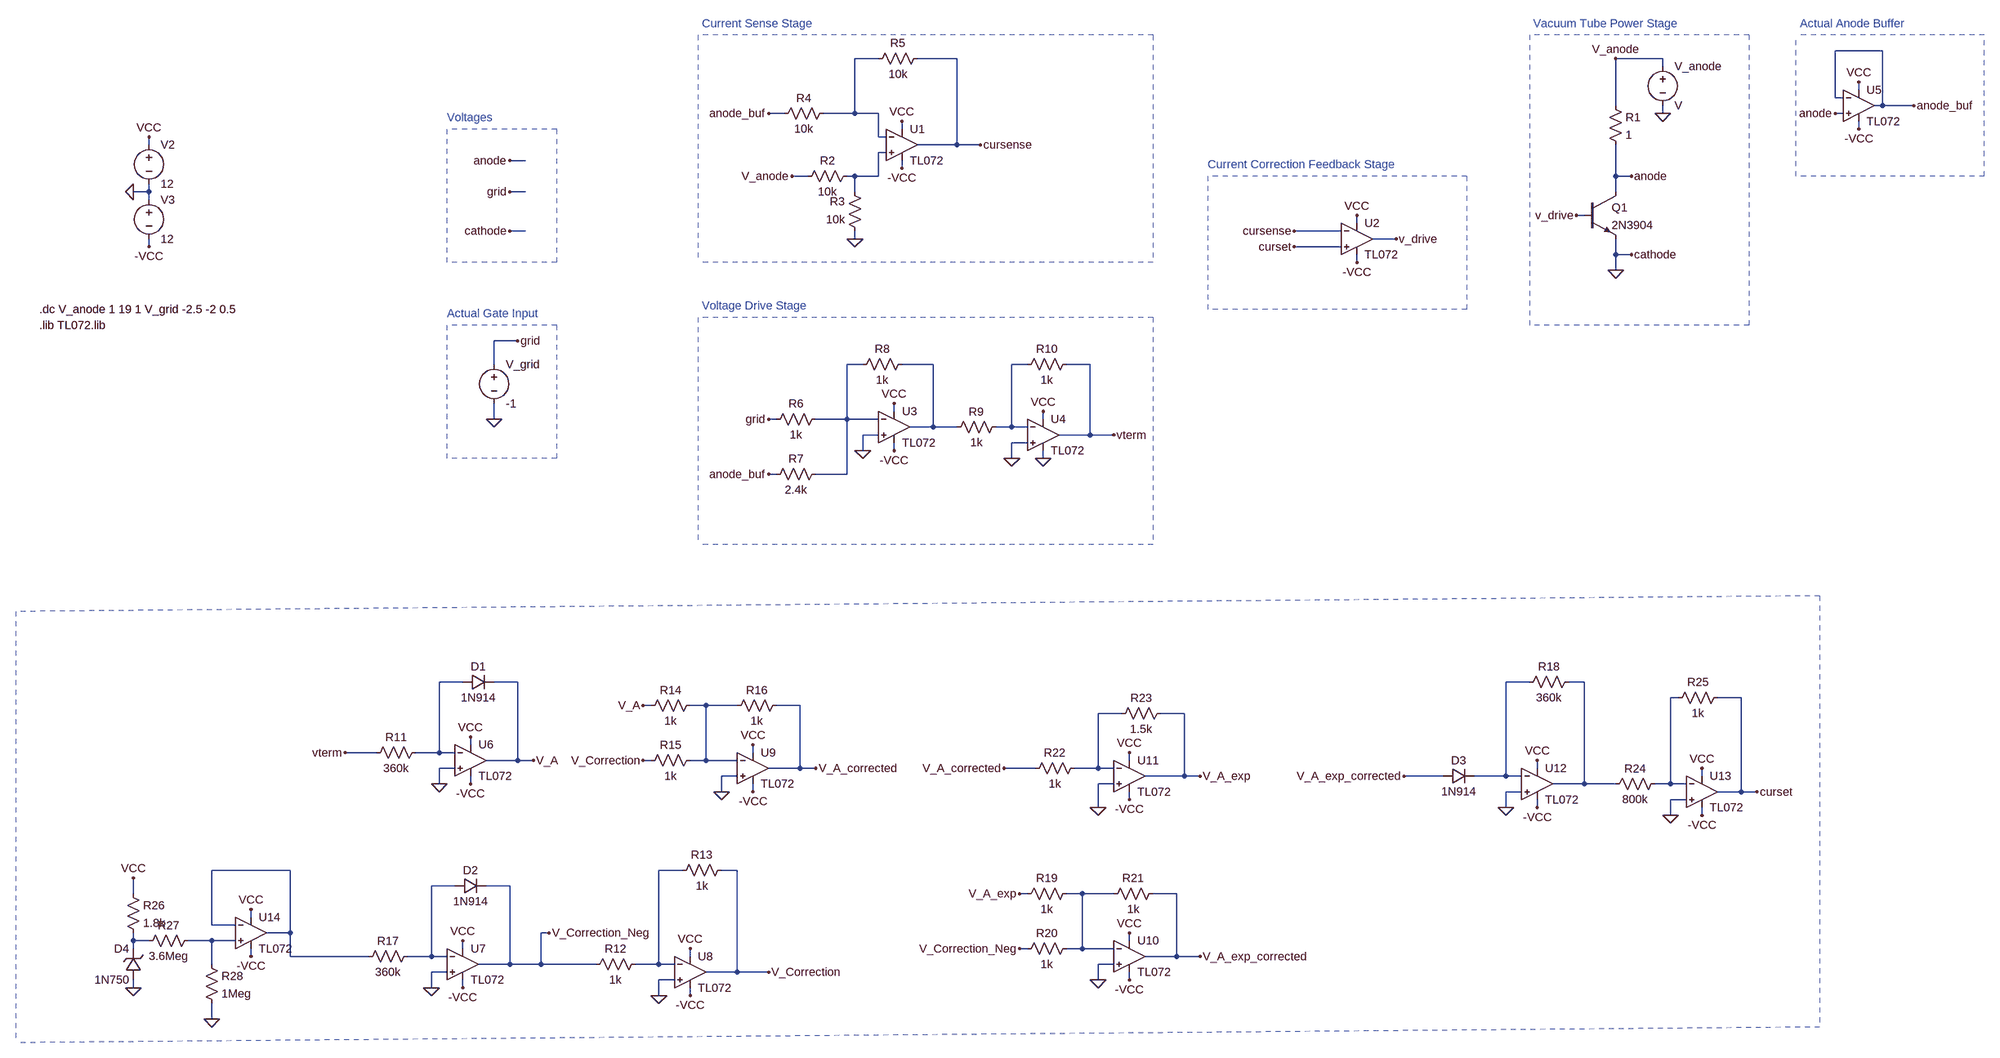
[diagram p0: schematic tube_third_iteration.asc]
tube_third_iteration.asc, the LTspice schematic file:
Version 4
SHEET 1 4020 1796
WIRE 3184 -400 3088 -400
WIRE 1136 -384 1088 -384
WIRE 1296 -384 1216 -384
WIRE 2736 -384 2640 -384
WIRE 2736 -368 2736 -384
WIRE 3136 -320 3136 -336
WIRE 3088 -304 3088 -400
WIRE 3104 -304 3088 -304
WIRE 2640 -288 2640 -384
WIRE 3184 -288 3184 -400
WIRE 3184 -288 3168 -288
WIRE 3248 -288 3184 -288
WIRE 944 -272 912 -272
WIRE 1088 -272 1088 -384
WIRE 1088 -272 1024 -272
WIRE 1136 -272 1088 -272
WIRE 2736 -272 2736 -288
WIRE 3104 -272 3088 -272
WIRE 1184 -240 1184 -256
WIRE 3136 -240 3136 -256
WIRE 1136 -224 1136 -272
WIRE 1152 -224 1136 -224
WIRE -352 -208 -352 -224
WIRE 1296 -208 1296 -384
WIRE 1296 -208 1216 -208
WIRE 1344 -208 1296 -208
WIRE 1152 -192 1136 -192
WIRE 416 -176 384 -176
WIRE 1184 -160 1184 -176
WIRE 992 -144 960 -144
WIRE 1088 -144 1072 -144
WIRE 1136 -144 1136 -192
WIRE 1136 -144 1088 -144
WIRE 2640 -144 2640 -208
WIRE 2672 -144 2640 -144
WIRE -352 -112 -352 -128
WIRE -352 -112 -384 -112
WIRE 416 -112 384 -112
WIRE 1088 -112 1088 -144
WIRE 2640 -112 2640 -144
WIRE -352 -96 -352 -112
WIRE 2576 -64 2560 -64
WIRE 2112 -48 2112 -64
WIRE 416 -32 384 -32
WIRE 2080 -32 1984 -32
WIRE 1088 -16 1088 -32
WIRE 2192 -16 2144 -16
WIRE -352 0 -352 -16
WIRE 2080 0 1984 0
WIRE 2640 16 2640 -16
WIRE 2672 16 2640 16
WIRE 2112 32 2112 16
WIRE 2640 48 2640 16
WIRE 400 192 352 192
WIRE 352 240 352 192
WIRE 1104 240 1072 240
WIRE 1248 240 1184 240
WIRE 1440 240 1408 240
WIRE 1568 240 1520 240
WIRE 1168 336 1168 320
WIRE 352 352 352 320
WIRE 928 352 912 352
WIRE 1072 352 1072 240
WIRE 1072 352 1008 352
WIRE 1136 352 1072 352
WIRE 1472 352 1472 336
WIRE 1248 368 1248 240
WIRE 1248 368 1200 368
WIRE 1296 368 1248 368
WIRE 1408 368 1408 240
WIRE 1408 368 1376 368
WIRE 1440 368 1408 368
WIRE 1136 384 1104 384
WIRE 1568 384 1568 240
WIRE 1568 384 1504 384
WIRE 1616 384 1568 384
WIRE 1440 400 1408 400
WIRE 1104 416 1104 384
WIRE 1168 416 1168 400
WIRE 1408 432 1408 400
WIRE 1472 432 1472 416
WIRE 928 464 912 464
WIRE 1072 464 1072 352
WIRE 1072 464 1008 464
WIRE 288 1040 240 1040
WIRE 400 1040 352 1040
WIRE 2464 1040 2416 1040
WIRE 2576 1040 2544 1040
WIRE 2768 1072 2752 1072
WIRE 2896 1072 2848 1072
WIRE 672 1088 656 1088
WIRE 784 1088 752 1088
WIRE 848 1088 784 1088
WIRE 976 1088 928 1088
WIRE 1632 1104 1584 1104
WIRE 1760 1104 1712 1104
WIRE 304 1168 304 1152
WIRE 112 1184 48 1184
WIRE 240 1184 240 1040
WIRE 240 1184 192 1184
WIRE 272 1184 240 1184
WIRE 880 1184 880 1168
WIRE 400 1200 400 1040
WIRE 400 1200 336 1200
WIRE 432 1200 400 1200
WIRE 672 1200 656 1200
WIRE 784 1200 784 1088
WIRE 784 1200 752 1200
WIRE 848 1200 784 1200
WIRE 1648 1200 1648 1184
WIRE 272 1216 240 1216
WIRE 976 1216 976 1088
WIRE 976 1216 912 1216
WIRE 1008 1216 976 1216
WIRE 1456 1216 1392 1216
WIRE 1584 1216 1584 1104
WIRE 1584 1216 1536 1216
WIRE 1616 1216 1584 1216
WIRE 2480 1216 2480 1200
WIRE 848 1232 816 1232
WIRE 1760 1232 1760 1104
WIRE 1760 1232 1680 1232
WIRE 1792 1232 1760 1232
WIRE 2288 1232 2208 1232
WIRE 2416 1232 2416 1040
WIRE 2416 1232 2352 1232
WIRE 2448 1232 2416 1232
WIRE 2816 1232 2816 1216
WIRE 240 1248 240 1216
WIRE 304 1248 304 1232
WIRE 1616 1248 1584 1248
WIRE 2576 1248 2576 1040
WIRE 2576 1248 2512 1248
WIRE 2640 1248 2576 1248
WIRE 2752 1248 2752 1072
WIRE 2752 1248 2720 1248
WIRE 2784 1248 2752 1248
WIRE 816 1264 816 1232
WIRE 880 1264 880 1248
WIRE 2448 1264 2416 1264
WIRE 2896 1264 2896 1072
WIRE 2896 1264 2848 1264
WIRE 2928 1264 2896 1264
WIRE 1648 1280 1648 1264
WIRE 2784 1280 2752 1280
WIRE 1584 1296 1584 1248
WIRE 2416 1296 2416 1264
WIRE 2480 1296 2480 1280
WIRE 2752 1312 2752 1280
WIRE 2816 1312 2816 1296
WIRE -64 1424 -224 1424
WIRE 736 1424 688 1424
WIRE 848 1424 816 1424
WIRE 272 1456 224 1456
WIRE 384 1456 336 1456
WIRE -384 1472 -384 1440
WIRE 1440 1472 1424 1472
WIRE 1552 1472 1520 1472
WIRE 1616 1472 1552 1472
WIRE 1744 1472 1696 1472
WIRE -144 1520 -144 1504
WIRE -224 1536 -224 1424
WIRE -176 1536 -224 1536
WIRE -64 1552 -64 1424
WIRE -64 1552 -112 1552
WIRE 464 1552 448 1552
WIRE -384 1568 -384 1552
WIRE -352 1568 -384 1568
WIRE -224 1568 -272 1568
WIRE -176 1568 -224 1568
WIRE 1648 1568 1648 1552
WIRE -384 1584 -384 1568
WIRE 288 1584 288 1568
WIRE 1440 1584 1424 1584
WIRE 1552 1584 1552 1472
WIRE 1552 1584 1520 1584
WIRE 1616 1584 1552 1584
WIRE -144 1600 -144 1584
WIRE -64 1600 -64 1552
WIRE 96 1600 -64 1600
WIRE 224 1600 224 1456
WIRE 224 1600 176 1600
WIRE 256 1600 224 1600
WIRE 752 1600 752 1584
WIRE 1744 1600 1744 1472
WIRE 1744 1600 1680 1600
WIRE 1792 1600 1744 1600
WIRE -224 1616 -224 1568
WIRE 384 1616 384 1456
WIRE 384 1616 320 1616
WIRE 448 1616 448 1552
WIRE 448 1616 384 1616
WIRE 560 1616 448 1616
WIRE 688 1616 688 1424
WIRE 688 1616 640 1616
WIRE 720 1616 688 1616
WIRE 1616 1616 1584 1616
WIRE 256 1632 224 1632
WIRE 848 1632 848 1424
WIRE 848 1632 784 1632
WIRE 912 1632 848 1632
WIRE 720 1648 688 1648
WIRE 1584 1648 1584 1616
WIRE 1648 1648 1648 1632
WIRE -384 1664 -384 1648
WIRE 224 1664 224 1632
WIRE 288 1664 288 1648
WIRE 688 1680 688 1648
WIRE 752 1680 752 1664
WIRE -224 1728 -224 1696
FLAG -384 -112 0
FLAG -352 -224 VCC
FLAG -352 0 -VCC
FLAG 2640 48 0
FLAG 3248 -288 anode_buf
FLAG 1088 -16 0
FLAG 1184 -256 VCC
FLAG 1184 -160 -VCC
FLAG 912 -272 anode_buf
FLAG 1344 -208 cursense
FLAG 1984 -32 cursense
FLAG 2112 -64 VCC
FLAG 2112 32 -VCC
FLAG 400 192 grid
FLAG 352 352 0
FLAG 1104 416 0
FLAG 1168 320 VCC
FLAG 912 464 anode_buf
FLAG 912 352 grid
FLAG 1408 432 0
FLAG 1472 336 VCC
FLAG 1616 384 vterm
FLAG 1168 416 -VCC
FLAG 1472 432 0
FLAG 3136 -336 VCC
FLAG 3136 -240 -VCC
FLAG 2736 -272 0
FLAG 2640 -384 V_anode
FLAG 960 -144 V_anode
FLAG 2672 -144 anode
FLAG 3088 -272 anode
FLAG 2672 16 cathode
FLAG 2192 -16 v_drive
FLAG 2560 -64 v_drive
FLAG 384 -112 grid
FLAG 384 -176 anode
FLAG 384 -32 cathode
FLAG 224 1664 0
FLAG 240 1248 0
FLAG 688 1680 0
FLAG 912 1632 V_Correction
FLAG 656 1088 V_A
FLAG 656 1200 V_Correction
FLAG 816 1264 0
FLAG 1008 1216 V_A_corrected
FLAG 2416 1296 0
FLAG 464 1552 V_Correction_Neg
FLAG 1392 1216 V_A_corrected
FLAG 1584 1648 0
FLAG 1424 1472 V_A_exp
FLAG 1792 1232 V_A_exp
FLAG 1792 1600 V_A_exp_corrected
FLAG 1424 1584 V_Correction_Neg
FLAG 2208 1232 V_A_exp_corrected
FLAG 1584 1296 0
FLAG 432 1200 V_A
FLAG 304 1152 VCC
FLAG 304 1248 -VCC
FLAG 880 1168 VCC
FLAG 880 1264 -VCC
FLAG 288 1568 VCC
FLAG 288 1664 -VCC
FLAG 752 1584 VCC
FLAG 752 1680 -VCC
FLAG 1648 1184 VCC
FLAG 1648 1280 -VCC
FLAG 1648 1552 VCC
FLAG 1648 1648 -VCC
FLAG 2480 1200 VCC
FLAG 2480 1296 -VCC
FLAG 48 1184 vterm
FLAG 2816 1216 VCC
FLAG 2816 1312 -VCC
FLAG 2752 1312 0
FLAG 2928 1264 curset
FLAG 1984 0 curset
FLAG -384 1664 0
FLAG -224 1728 0
FLAG -384 1440 VCC
FLAG -144 1504 VCC
FLAG -144 1600 -VCC
SYMBOL npn 2576 -112 R0
SYMATTR InstName Q1
SYMATTR Value 2N3904
SYMBOL voltage -352 -224 R0
WINDOW 123 0 0 Left 0
WINDOW 39 0 0 Left 0
SYMATTR InstName V2
SYMATTR Value 12
SYMBOL voltage -352 -112 R0
WINDOW 123 0 0 Left 0
WINDOW 39 0 0 Left 0
SYMATTR InstName V3
SYMATTR Value 12
SYMBOL res 1088 -160 R90
WINDOW 0 0 56 VBottom 2
WINDOW 3 32 56 VTop 2
SYMATTR InstName R2
SYMATTR Value 10k
SYMBOL res 1104 -16 R180
WINDOW 0 36 76 Left 2
WINDOW 3 36 40 Left 2
SYMATTR InstName R3
SYMATTR Value 10k
SYMBOL res 1040 -288 R90
WINDOW 0 0 56 VBottom 2
WINDOW 3 32 56 VTop 2
SYMATTR InstName R4
SYMATTR Value 10k
SYMBOL res 1232 -400 R90
WINDOW 0 0 56 VBottom 2
WINDOW 3 32 56 VTop 2
SYMATTR InstName R5
SYMATTR Value 10k
SYMBOL voltage 352 224 R0
WINDOW 123 0 0 Left 0
WINDOW 39 0 0 Left 0
SYMATTR InstName V_grid
SYMATTR Value -1
SYMBOL res 1024 336 R90
WINDOW 0 0 56 VBottom 2
WINDOW 3 32 56 VTop 2
SYMATTR InstName R6
SYMATTR Value 1k
SYMBOL res 1024 448 R90
WINDOW 0 0 56 VBottom 2
WINDOW 3 32 56 VTop 2
SYMATTR InstName R7
SYMATTR Value 2.4k
SYMBOL res 1200 224 R90
WINDOW 0 0 56 VBottom 2
WINDOW 3 32 56 VTop 2
SYMATTR InstName R8
SYMATTR Value 1k
SYMBOL res 1392 352 R90
WINDOW 0 0 56 VBottom 2
WINDOW 3 32 56 VTop 2
SYMATTR InstName R9
SYMATTR Value 1k
SYMBOL res 1536 224 R90
WINDOW 0 0 56 VBottom 2
WINDOW 3 32 56 VTop 2
SYMATTR InstName R10
SYMATTR Value 1k
SYMBOL voltage 2736 -384 R0
SYMATTR InstName V_anode
SYMBOL res 2624 -304 R0
SYMATTR InstName R1
SYMATTR Value 1
SYMBOL res 208 1168 R90
WINDOW 0 0 56 VBottom 2
WINDOW 3 32 56 VTop 2
SYMATTR InstName R11
SYMATTR Value 360k
SYMBOL res 656 1600 R90
WINDOW 0 0 56 VBottom 2
WINDOW 3 32 56 VTop 2
SYMATTR InstName R12
SYMATTR Value 1k
SYMBOL res 832 1408 R90
WINDOW 0 0 56 VBottom 2
WINDOW 3 32 56 VTop 2
SYMATTR InstName R13
SYMATTR Value 1k
SYMBOL res 768 1072 R90
WINDOW 0 0 56 VBottom 2
WINDOW 3 32 56 VTop 2
SYMATTR InstName R14
SYMATTR Value 1k
SYMBOL res 768 1184 R90
WINDOW 0 0 56 VBottom 2
WINDOW 3 32 56 VTop 2
SYMATTR InstName R15
SYMATTR Value 1k
SYMBOL res 944 1072 R90
WINDOW 0 0 56 VBottom 2
WINDOW 3 32 56 VTop 2
SYMATTR InstName R16
SYMATTR Value 1k
SYMBOL diode 288 1056 R270
WINDOW 0 32 32 VTop 2
WINDOW 3 0 32 VBottom 2
SYMATTR InstName D1
SYMATTR Value 1N914
SYMBOL diode 272 1472 R270
WINDOW 0 32 32 VTop 2
WINDOW 3 0 32 VBottom 2
SYMATTR InstName D2
SYMATTR Value 1N914
SYMBOL diode 2288 1248 R270
WINDOW 0 32 32 VTop 2
WINDOW 3 0 32 VBottom 2
SYMATTR InstName D3
SYMATTR Value 1N914
SYMBOL res 192 1584 R90
WINDOW 0 0 56 VBottom 2
WINDOW 3 32 56 VTop 2
SYMATTR InstName R17
SYMATTR Value 360k
SYMBOL res 2560 1024 R90
WINDOW 0 0 56 VBottom 2
WINDOW 3 32 56 VTop 2
SYMATTR InstName R18
SYMATTR Value 360k
SYMBOL res 1536 1456 R90
WINDOW 0 0 56 VBottom 2
WINDOW 3 32 56 VTop 2
SYMATTR InstName R19
SYMATTR Value 1k
SYMBOL res 1536 1568 R90
WINDOW 0 0 56 VBottom 2
WINDOW 3 32 56 VTop 2
SYMATTR InstName R20
SYMATTR Value 1k
SYMBOL res 1712 1456 R90
WINDOW 0 0 56 VBottom 2
WINDOW 3 32 56 VTop 2
SYMATTR InstName R21
SYMATTR Value 1k
SYMBOL res 1440 1232 R270
WINDOW 0 32 56 VTop 2
WINDOW 3 0 56 VBottom 2
SYMATTR InstName R22
SYMATTR Value 1k
SYMBOL res 1728 1088 R90
WINDOW 0 0 56 VBottom 2
WINDOW 3 32 56 VTop 2
SYMATTR InstName R23
SYMATTR Value 1.5k
SYMBOL res 2736 1232 R90
WINDOW 0 0 56 VBottom 2
WINDOW 3 32 56 VTop 2
SYMATTR InstName R24
SYMATTR Value 800k
SYMBOL res 2864 1056 R90
WINDOW 0 0 56 VBottom 2
WINDOW 3 32 56 VTop 2
SYMATTR InstName R25
SYMATTR Value 1k
SYMBOL zener -368 1648 R180
WINDOW 0 24 64 Left 2
WINDOW 3 24 0 Left 2
SYMATTR InstName D4
SYMATTR Value 1N750
SYMATTR Description Diode
SYMATTR Type diode
SYMBOL res -400 1456 R0
SYMATTR InstName R26
SYMATTR Value 1.8k
SYMBOL res -256 1552 R90
WINDOW 0 0 56 VBottom 2
WINDOW 3 32 56 VTop 2
SYMATTR InstName R27
SYMATTR Value 3.6Meg
SYMBOL res -240 1600 R0
SYMATTR InstName R28
SYMATTR Value 1Meg
SYMBOL OpAmps\\opamp2 1184 -272 R0
SYMATTR InstName U1
SYMATTR Value TL072
SYMBOL OpAmps\\opamp2 2112 -80 R0
SYMATTR InstName U2
SYMATTR Value TL072
SYMBOL OpAmps\\opamp2 1168 304 R0
SYMATTR InstName U3
SYMATTR Value TL072
SYMBOL OpAmps\\opamp2 1472 320 R0
SYMATTR InstName U4
SYMATTR Value TL072
SYMBOL OpAmps\\opamp2 3136 -352 R0
SYMATTR InstName U5
SYMATTR Value TL072
SYMBOL OpAmps\\opamp2 304 1136 R0
SYMATTR InstName U6
SYMATTR Value TL072
SYMBOL OpAmps\\opamp2 288 1552 R0
SYMATTR InstName U7
SYMATTR Value TL072
SYMBOL OpAmps\\opamp2 752 1568 R0
SYMATTR InstName U8
SYMATTR Value TL072
SYMBOL OpAmps\\opamp2 880 1152 R0
SYMATTR InstName U9
SYMATTR Value TL072
SYMBOL OpAmps\\opamp2 1648 1536 R0
SYMATTR InstName U10
SYMATTR Value TL072
SYMBOL OpAmps\\opamp2 1648 1168 R0
SYMATTR InstName U11
SYMATTR Value TL072
SYMBOL OpAmps\\opamp2 2480 1184 R0
SYMATTR InstName U12
SYMATTR Value TL072
SYMBOL OpAmps\\opamp2 2816 1200 R0
SYMATTR InstName U13
SYMATTR Value TL072
SYMBOL OpAmps\\opamp2 -144 1488 R0
SYMATTR InstName U14
SYMATTR Value TL072
TEXT -576 128 Left 2 !.dc V_anode 1 19 1 V_grid -2.5 -2 0.5
TEXT 2472 -456 Left 2 ;Vacuum Tube Power Stage
TEXT 3016 -456 Left 2 ;Actual Anode Buffer
TEXT 256 136 Left 2 ;Actual Gate Input
TEXT 776 -456 Left 2 ;Current Sense Stage
TEXT 776 120 Left 2 ;Voltage Drive Stage
TEXT 1808 -168 Left 2 ;Current Correction Feedback Stage
TEXT 256 -264 Left 2 ;Voltages
TEXT -576 160 Left 2 !.lib TL072.lib
LINE Normal 2912 -432 2464 -432 2
LINE Normal 2464 -432 2464 160 2
LINE Normal 2912 160 2464 160 2
LINE Normal 2912 -432 2912 160 2
LINE Normal 3392 -432 3008 -432 2
LINE Normal 3392 -144 3008 -144 2
LINE Normal 3392 -144 3392 -432 2
LINE Normal 3008 -144 3008 -432 2
LINE Normal 480 160 256 160 2
LINE Normal 480 432 256 432 2
LINE Normal 480 432 480 160 2
LINE Normal 256 432 256 160 2
LINE Normal 768 -432 768 32 2
LINE Normal 1696 -432 1696 32 2
LINE Normal 1696 -432 768 -432 2
LINE Normal 1696 32 768 32 2
LINE Normal 1808 -144 1808 128 2
LINE Normal 2336 -144 2336 128 2
LINE Normal 2336 -144 1808 -144 2
LINE Normal 2336 128 1808 128 2
LINE Normal 768 144 768 608 2
LINE Normal 1696 144 1696 608 2
LINE Normal 1696 144 768 144 2
LINE Normal 1696 608 768 608 2
LINE Normal 480 -240 256 -240 2
LINE Normal 480 32 256 32 2
LINE Normal 480 32 480 -240 2
LINE Normal 256 32 256 -240 2
LINE Normal 3056 864 -624 896 2
LINE Normal 3056 1744 -624 1776 2
LINE Normal 3056 864 3056 1744 2
LINE Normal -624 896 -624 1776 2

The netlist it stands for:
* tube_third_iteration.asc
Q1 anode v_drive 0 0 2N3904
V2 VCC 0 12
V3 0 -VCC 12
R2 N002 V_anode 10k
R3 0 N002 10k
R4 N001 anode_buf 10k
R5 cursense N001 10k
V_grid grid 0 -1
R6 N003 grid 1k
R7 N003 anode_buf 2.4k
R8 N004 N003 1k
R9 N005 N004 1k
R10 vterm N005 1k
V_anode V_anode 0 V
R1 V_anode anode 1
R11 N006 vterm 360k
R12 N013 V_Correction_Neg 1k
R13 V_Correction N013 1k
R14 N010 V_A 1k
R15 N010 V_Correction 1k
R16 V_A_corrected N010 1k
D1 N006 V_A 1N914
D2 N014 V_Correction_Neg 1N914
D3 V_A_exp_corrected N007 1N914
R17 N014 N012 360k
R18 N008 N007 360k
R19 N015 V_A_exp 1k
R20 N015 V_Correction_Neg 1k
R21 V_A_exp_corrected N015 1k
R22 V_A_corrected N011 1k
R23 V_A_exp N011 1.5k
R24 N009 N008 800k
R25 curset N009 1k
D4 0 N016 1N750
R26 VCC N016 1.8k
R27 N017 N016 3.6Meg
R28 N017 0 1Meg
XU1 N002 N001 VCC -VCC cursense TL072  ; pins In+ In- V+ V- OUT
XU2 curset cursense VCC -VCC v_drive TL072  ; pins In+ In- V+ V- OUT
XU3 0 N003 VCC -VCC N004 TL072  ; pins In+ In- V+ V- OUT
XU4 0 N005 VCC 0 vterm TL072  ; pins In+ In- V+ V- OUT
XU5 anode anode_buf VCC -VCC anode_buf TL072  ; pins In+ In- V+ V- OUT
XU6 0 N006 VCC -VCC V_A TL072  ; pins In+ In- V+ V- OUT
XU7 0 N014 VCC -VCC V_Correction_Neg TL072  ; pins In+ In- V+ V- OUT
XU8 0 N013 VCC -VCC V_Correction TL072  ; pins In+ In- V+ V- OUT
XU9 0 N010 VCC -VCC V_A_corrected TL072  ; pins In+ In- V+ V- OUT
XU10 0 N015 VCC -VCC V_A_exp_corrected TL072  ; pins In+ In- V+ V- OUT
XU11 0 N011 VCC -VCC V_A_exp TL072  ; pins In+ In- V+ V- OUT
XU12 0 N007 VCC -VCC N008 TL072  ; pins In+ In- V+ V- OUT
XU13 0 N009 VCC -VCC curset TL072  ; pins In+ In- V+ V- OUT
XU14 N017 N012 VCC -VCC N012 TL072  ; pins In+ In- V+ V- OUT
.model D D
.lib standard.dio
.model NPN NPN
.model PNP PNP
.lib standard.bjt
.dc V_anode 1 19 1 V_grid -2.5 -2 0.5
* Vacuum Tube Power Stage
* Actual Anode Buffer
* Actual Gate Input
* Current Sense Stage
* Voltage Drive Stage
* Current Correction Feedback Stage
* Voltages
.lib TL072.lib
.backanno
.end